# Altium project CurrentSensor_PCB.PrjPcb
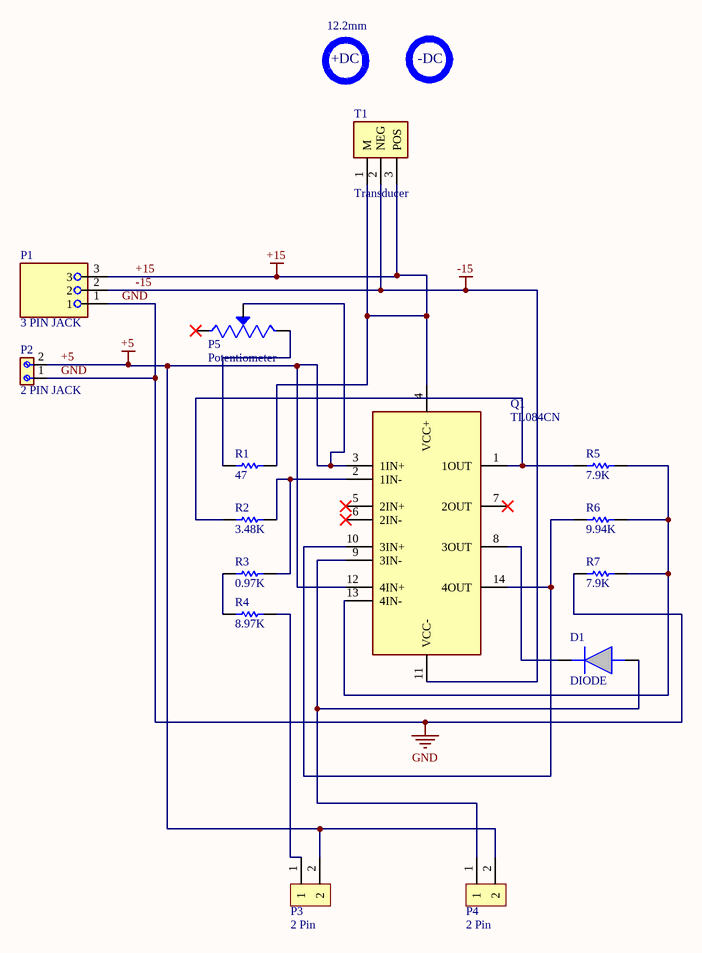
[diagram p0: Sheet1.SchDoc]
3 sheets, 123 parts. Net scope: global (net labels, ports and power ports of the same name join across sheets).
Board files: PCB1.PcbDoc, PCB2.PcbDoc, PCB3.PcbDoc
Sheets:
  Sheet1.SchDoc
  Sheet2.SchDoc
  Sheet3.SchDoc

## Sheet Sheet1.SchDoc
size A4; SheetNumber: 1; SheetTotal: 1

### Parts
D1  DIODE  [Diode]
P1  3 PIN JACK  [3 PIN JACK]
P2  2 PIN JACK  [2 PIN JACK]
P3  2 Pin  [2 PIN]
P4  2 Pin  [2 PIN]
P5  Potentiometer  [Potentiometer]
Q1  TL084CN  [TL084CN]
R1  47  [47]
R2  3.48K  [3.48K]
R3  0.97K  [0.97K]
R4  8.97K  [8.97K]
R5  7.9K  [7.90K]
R6  9.94K  [9.94K]
R7  7.9K  [7.90K]
T1  Transducer  [Transducer]

### Nets
+5: P2.2 P3.2 P4.2 P5.2(WIPER) Q1.3(1IN+) Q1.12(4IN+)
+15: P1.3 Q1.4(VCC+) R1.2 T1.1(M) T1.3(POS)
-15: P1.2 Q1.11(VCC-) T1.2(NEG)
GND: P1.1 P2.1 R7.1
NetD1_1: D1.1(K) Q1.8(3OUT)
NetD1_2: D1.2(A) P4.1 Q1.9(3IN-)
NetP3_1: P3.1 R4.2
NetP5_3: P5.3(CW) R1.1
NetQ1_1: Q1.1(1OUT) R2.1 R5.1
NetQ1_2: Q1.2(1IN-) R2.2 R3.2
NetQ1_10: Q1.10(3IN+) Q1.14(4OUT) R6.1
NetQ1_13: Q1.13(4IN-) R5.2 R6.2 R7.2
NetR3_1: R3.1 R4.1

Not connected (* = marked no-connect by the designer): P5 1(CCW)*; Q1 5(2IN+)* 6(2IN-)* 7(2OUT)*

### Notes on the sheet
- 12.2mm
- +DC
- -DC

### Library data of the parts
D1 = DIODE: 1N4007S
P3 P4 = 2 Pin: 22272021
R1 = 47: MFR-25FRF52-47R
R2 = 3.48K: MFR-25FBF52-3K48
R3 = 0.97K: MFR-25FRF52-976R
R4 = 8.97K: MFR-25FBF52-8K87
R5 R7 = 7.9K: MFR-25FBF52-7K87
R6 = 9.94K: MFR-25FTE52-9K76
T1 = Transducer: LA55-P

## Sheet Sheet2.SchDoc
size A2; SheetNumber: 2; SheetTotal: 2
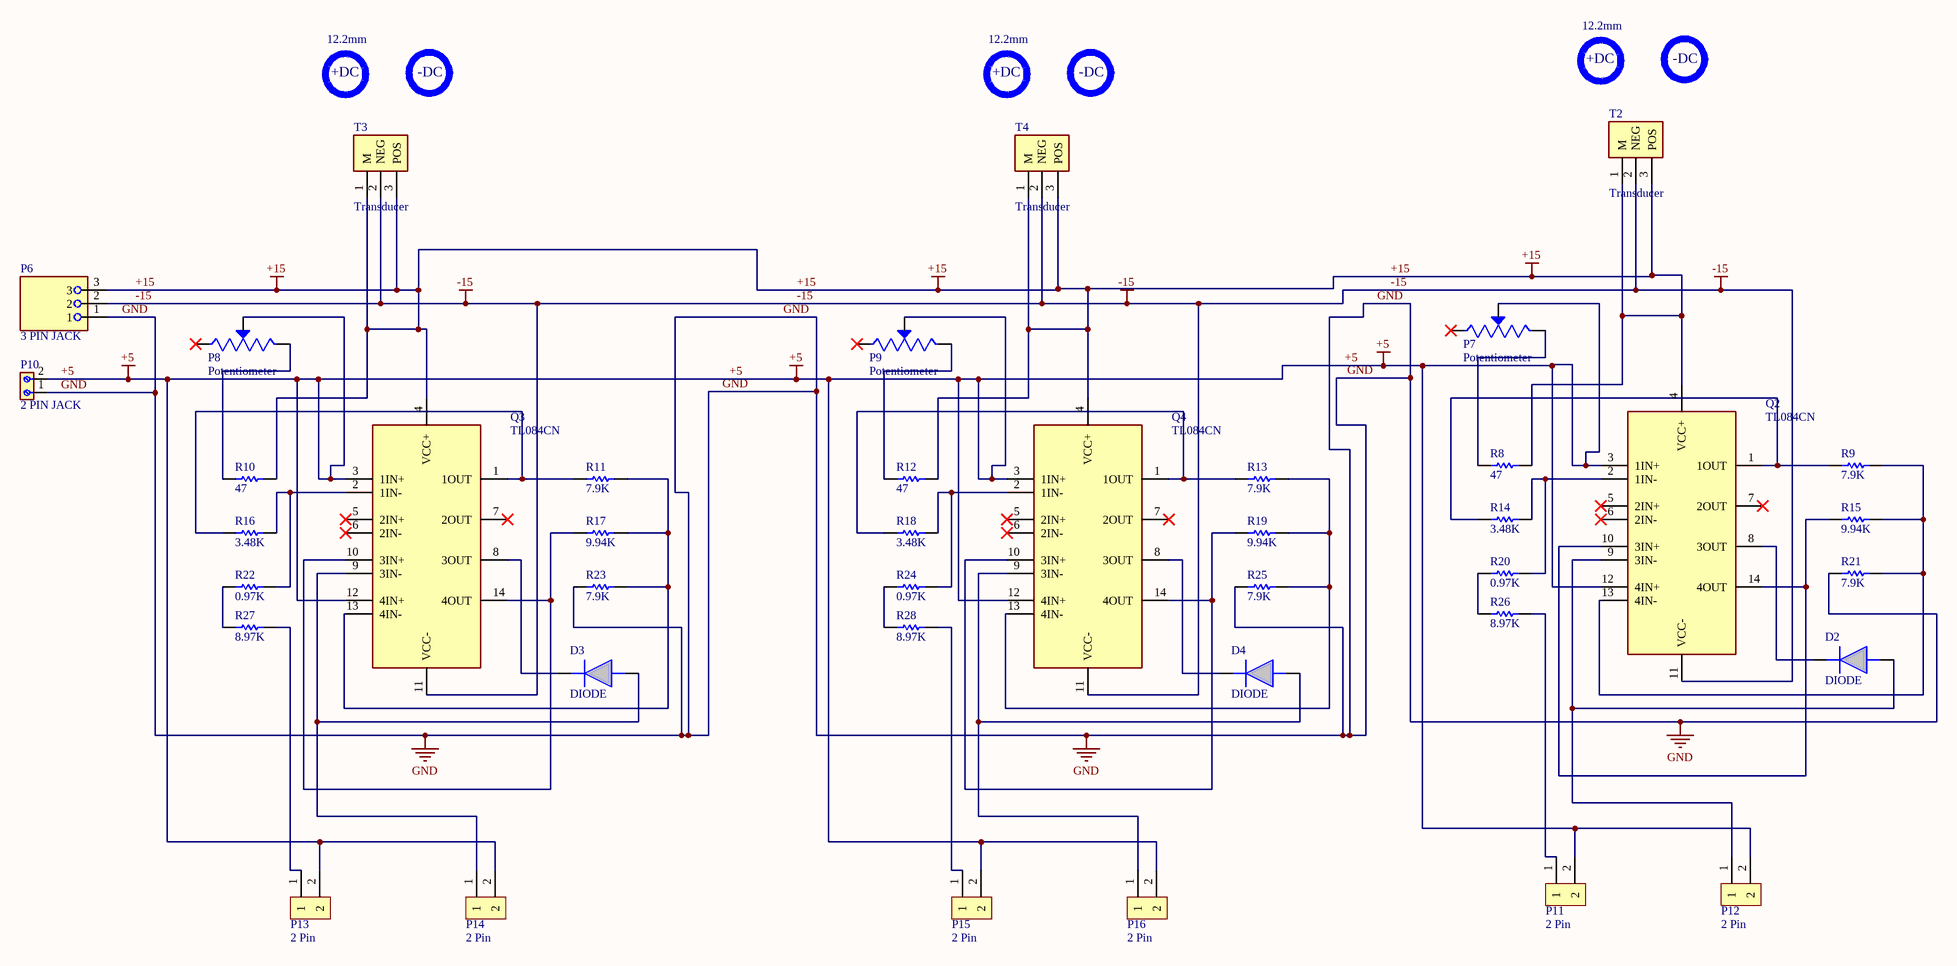
[diagram p1: Sheet2.SchDoc]

### Parts
D2  DIODE  [Diode]
D3  DIODE  [Diode]
D4  DIODE  [Diode]
P6  3 PIN JACK  [3 PIN JACK]
P7  Potentiometer  [Potentiometer]
P8  Potentiometer  [Potentiometer]
P9  Potentiometer  [Potentiometer]
P10  2 PIN JACK  [2 PIN JACK]
P11  2 Pin  [2 PIN]
P12  2 Pin  [2 PIN]
P13  2 Pin  [2 PIN]
P14  2 Pin  [2 PIN]
P15  2 Pin  [2 PIN]
P16  2 Pin  [2 PIN]
Q2  TL084CN  [TL084CN]
Q3  TL084CN  [TL084CN]
Q4  TL084CN  [TL084CN]
R8  47  [47]
R9  7.9K  [7.90K]
R10  47  [47]
R11  7.9K  [7.90K]
R12  47  [47]
R13  7.9K  [7.90K]
R14  3.48K  [3.48K]
R15  9.94K  [9.94K]
R16  3.48K  [3.48K]
R17  9.94K  [9.94K]
R18  3.48K  [3.48K]
R19  9.94K  [9.94K]
R20  0.97K  [0.97K]
R21  7.9K  [7.90K]
R22  0.97K  [0.97K]
R23  7.9K  [7.90K]
R24  0.97K  [0.97K]
R25  7.9K  [7.90K]
R26  8.97K  [8.97K]
R27  8.97K  [8.97K]
R28  8.97K  [8.97K]
T2  Transducer  [Transducer]
T3  Transducer  [Transducer]
T4  Transducer  [Transducer]

### Nets
+5: P7.2(WIPER) P8.2(WIPER) P9.2(WIPER) P10.2 P11.2 P12.2 P13.2 P14.2 P15.2 P16.2 Q2.3(1IN+) Q2.12(4IN+) Q3.3(1IN+) Q3.12(4IN+) Q4.3(1IN+) Q4.12(4IN+)
+15: P6.3 Q2.4(VCC+) Q3.4(VCC+) Q4.4(VCC+) R8.2 R10.2 R12.2 T2.1(M) T2.3(POS) T3.1(M) T3.3(POS) T4.1(M) T4.3(POS)
-15: P6.2 Q2.11(VCC-) Q3.11(VCC-) Q4.11(VCC-) T2.2(NEG) T3.2(NEG) T4.2(NEG)
GND: P6.1 P10.1 R21.1 R23.1 R25.1
NetD2_1: D2.1(K) Q2.8(3OUT)
NetD2_2: D2.2(A) P12.1 Q2.9(3IN-)
NetD3_1: D3.1(K) Q3.8(3OUT)
NetD3_2: D3.2(A) P14.1 Q3.9(3IN-)
NetD4_1: D4.1(K) Q4.8(3OUT)
NetD4_2: D4.2(A) P16.1 Q4.9(3IN-)
NetP7_3: P7.3(CW) R8.1
NetP8_3: P8.3(CW) R10.1
NetP9_3: P9.3(CW) R12.1
NetP11_1: P11.1 R26.2
NetP13_1: P13.1 R27.2
NetP15_1: P15.1 R28.2
NetQ2_1: Q2.1(1OUT) R9.1 R14.1
NetQ2_2: Q2.2(1IN-) R14.2 R20.2
NetQ2_10: Q2.10(3IN+) Q2.14(4OUT) R15.1
NetQ2_13: Q2.13(4IN-) R9.2 R15.2 R21.2
NetQ3_1: Q3.1(1OUT) R11.1 R16.1
NetQ3_2: Q3.2(1IN-) R16.2 R22.2
NetQ3_10: Q3.10(3IN+) Q3.14(4OUT) R17.1
NetQ3_13: Q3.13(4IN-) R11.2 R17.2 R23.2
NetQ4_1: Q4.1(1OUT) R13.1 R18.1
NetQ4_2: Q4.2(1IN-) R18.2 R24.2
NetQ4_10: Q4.10(3IN+) Q4.14(4OUT) R19.1
NetQ4_13: Q4.13(4IN-) R13.2 R19.2 R25.2
NetR20_1: R20.1 R26.1
NetR22_1: R22.1 R27.1
NetR24_1: R24.1 R28.1

Not connected (* = marked no-connect by the designer): P7 1(CCW)*; P8 1(CCW)*; P9 1(CCW)*; Q2 5(2IN+)* 6(2IN-)* 7(2OUT)*; Q3 5(2IN+)* 6(2IN-)* 7(2OUT)*; Q4 5(2IN+)* 6(2IN-)* 7(2OUT)*

### Notes on the sheet
- 12.2mm
- +DC
- -DC

### Library data of the parts
D2-D4 = DIODE: 1N4007S
P11-P16 = 2 Pin: 22272021
R8 R10 R12 = 47: MFR-25FRF52-47R
R9 R11 R13 R21 R23 R25 = 7.9K: MFR-25FBF52-7K87
R14 R16 R18 = 3.48K: MFR-25FBF52-3K48
R15 R17 R19 = 9.94K: MFR-25FTE52-9K76
R20 R22 R24 = 0.97K: MFR-25FRF52-976R
R26-R28 = 8.97K: MFR-25FBF52-8K87
T2-T4 = Transducer: LA55-P

## Sheet Sheet3.SchDoc
size A1; SheetNumber: 3; SheetTotal: 3
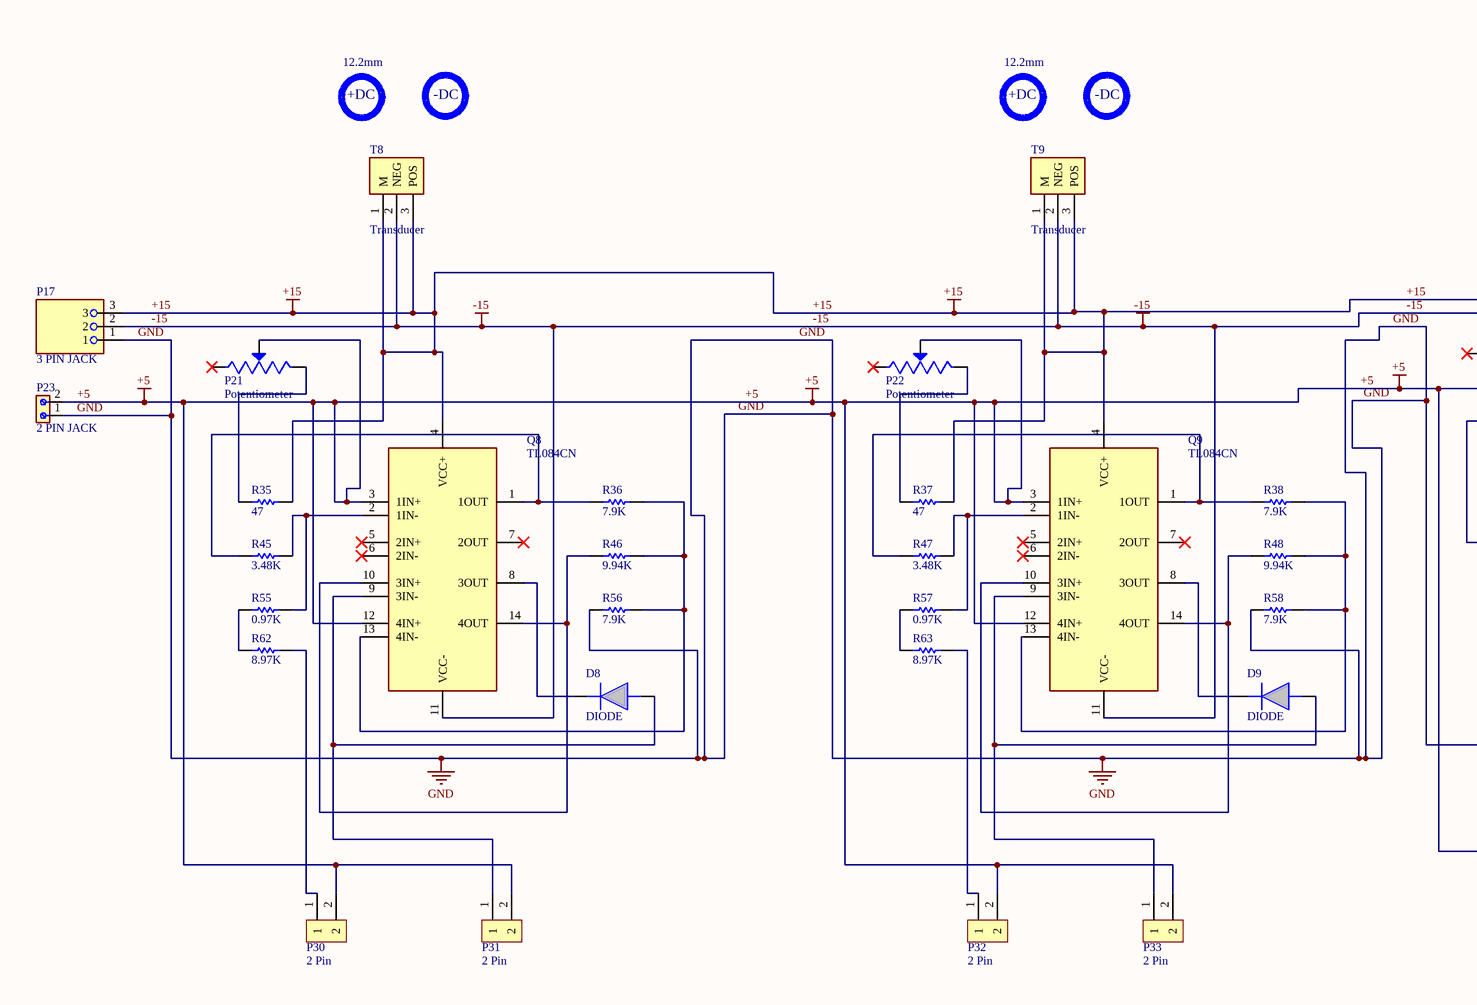
[diagram p2: Sheet3.SchDoc, left]
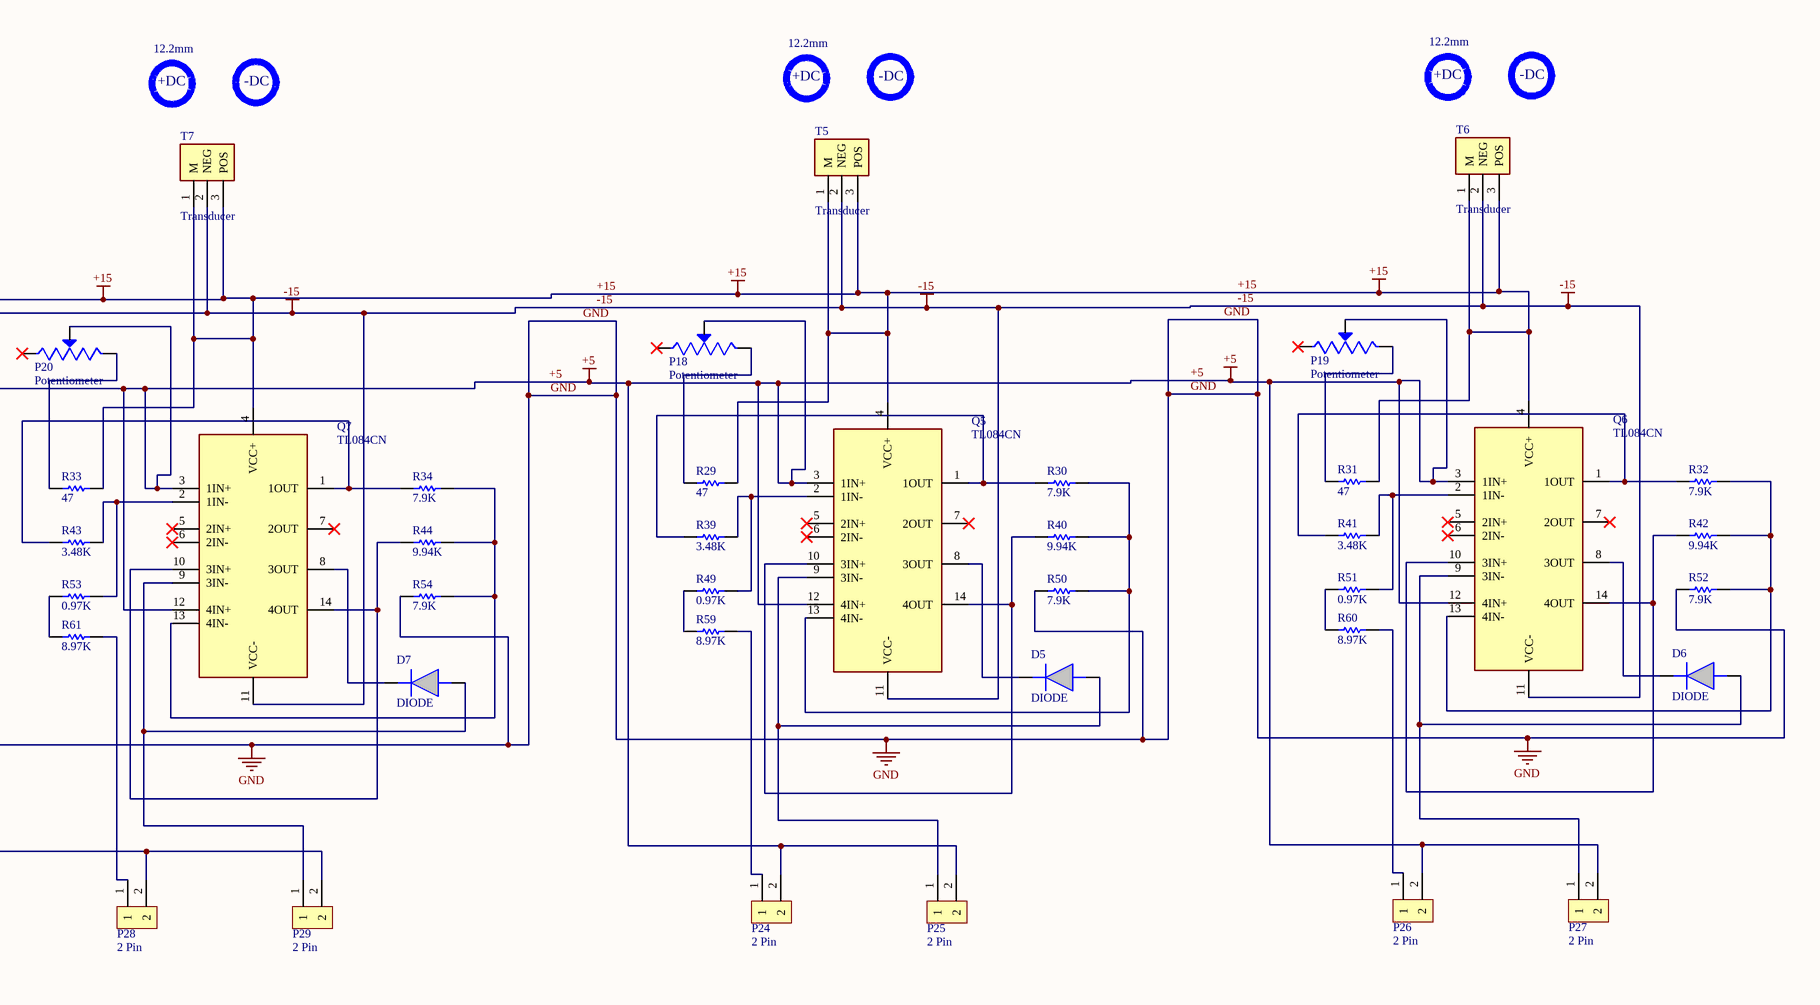
[diagram p3: Sheet3.SchDoc, right]

### Parts
D5  DIODE  [Diode]
D6  DIODE  [Diode]
D7  DIODE  [Diode]
D8  DIODE  [Diode]
D9  DIODE  [Diode]
P17  3 PIN JACK  [3 PIN JACK]
P18  Potentiometer  [Potentiometer]
P19  Potentiometer  [Potentiometer]
P20  Potentiometer  [Potentiometer]
P21  Potentiometer  [Potentiometer]
P22  Potentiometer  [Potentiometer]
P23  2 PIN JACK  [2 PIN JACK]
P24  2 Pin  [2 PIN]
P25  2 Pin  [2 PIN]
P26  2 Pin  [2 PIN]
P27  2 Pin  [2 PIN]
P28  2 Pin  [2 PIN]
P29  2 Pin  [2 PIN]
P30  2 Pin  [2 PIN]
P31  2 Pin  [2 PIN]
P32  2 Pin  [2 PIN]
P33  2 Pin  [2 PIN]
Q5  TL084CN  [TL084CN]
Q6  TL084CN  [TL084CN]
Q7  TL084CN  [TL084CN]
Q8  TL084CN  [TL084CN]
Q9  TL084CN  [TL084CN]
R29  47  [47]
R30  7.9K  [7.90K]
R31  47  [47]
R32  7.9K  [7.90K]
R33  47  [47]
R34  7.9K  [7.90K]
R35  47  [47]
R36  7.9K  [7.90K]
R37  47  [47]
R38  7.9K  [7.90K]
R39  3.48K  [3.48K]
R40  9.94K  [9.94K]
R41  3.48K  [3.48K]
R42  9.94K  [9.94K]
R43  3.48K  [3.48K]
R44  9.94K  [9.94K]
R45  3.48K  [3.48K]
R46  9.94K  [9.94K]
R47  3.48K  [3.48K]
R48  9.94K  [9.94K]
R49  0.97K  [0.97K]
R50  7.9K  [7.90K]
R51  0.97K  [0.97K]
R52  7.9K  [7.90K]
R53  0.97K  [0.97K]
R54  7.9K  [7.90K]
R55  0.97K  [0.97K]
R56  7.9K  [7.90K]
R57  0.97K  [0.97K]
R58  7.9K  [7.90K]
R59  8.97K  [8.97K]
R60  8.97K  [8.97K]
R61  8.97K  [8.97K]
R62  8.97K  [8.97K]
R63  8.97K  [8.97K]
T5  Transducer  [Transducer]
T6  Transducer  [Transducer]
T7  Transducer  [Transducer]
T8  Transducer  [Transducer]
T9  Transducer  [Transducer]

### Nets
+5: P18.2(WIPER) P19.2(WIPER) P20.2(WIPER) P21.2(WIPER) P22.2(WIPER) P23.2 P24.2 P25.2 P26.2 P27.2 P28.2 P29.2 P30.2 P31.2 P32.2 P33.2 Q5.3(1IN+) Q5.12(4IN+) Q6.3(1IN+) Q6.12(4IN+) Q7.3(1IN+) Q7.12(4IN+) Q8.3(1IN+) Q8.12(4IN+) Q9.3(1IN+) Q9.12(4IN+)
+15: P17.3 Q5.4(VCC+) Q6.4(VCC+) Q7.4(VCC+) Q8.4(VCC+) Q9.4(VCC+) R29.2 R31.2 R33.2 R35.2 R37.2 T5.1(M) T5.3(POS) T6.1(M) T6.3(POS) T7.1(M) T7.3(POS) T8.1(M) T8.3(POS) T9.1(M) T9.3(POS)
-15: P17.2 Q5.11(VCC-) Q6.11(VCC-) Q7.11(VCC-) Q8.11(VCC-) Q9.11(VCC-) T5.2(NEG) T6.2(NEG) T7.2(NEG) T8.2(NEG) T9.2(NEG)
GND: P17.1 P23.1 R50.1 R52.1 R54.1 R56.1 R58.1
NetD5_1: D5.1(K) Q5.8(3OUT)
NetD5_2: D5.2(A) P25.1 Q5.9(3IN-)
NetD6_1: D6.1(K) Q6.8(3OUT)
NetD6_2: D6.2(A) P27.1 Q6.9(3IN-)
NetD7_1: D7.1(K) Q7.8(3OUT)
NetD7_2: D7.2(A) P29.1 Q7.9(3IN-)
NetD8_1: D8.1(K) Q8.8(3OUT)
NetD8_2: D8.2(A) P31.1 Q8.9(3IN-)
NetD9_1: D9.1(K) Q9.8(3OUT)
NetD9_2: D9.2(A) P33.1 Q9.9(3IN-)
NetP18_3: P18.3(CW) R29.1
NetP19_3: P19.3(CW) R31.1
NetP20_3: P20.3(CW) R33.1
NetP21_3: P21.3(CW) R35.1
NetP22_3: P22.3(CW) R37.1
NetP24_1: P24.1 R59.2
NetP26_1: P26.1 R60.2
NetP28_1: P28.1 R61.2
NetP30_1: P30.1 R62.2
NetP32_1: P32.1 R63.2
NetQ5_1: Q5.1(1OUT) R30.1 R39.1
NetQ5_2: Q5.2(1IN-) R39.2 R49.2
NetQ5_10: Q5.10(3IN+) Q5.14(4OUT) R40.1
NetQ5_13: Q5.13(4IN-) R30.2 R40.2 R50.2
NetQ6_1: Q6.1(1OUT) R32.1 R41.1
NetQ6_2: Q6.2(1IN-) R41.2 R51.2
NetQ6_10: Q6.10(3IN+) Q6.14(4OUT) R42.1
NetQ6_13: Q6.13(4IN-) R32.2 R42.2 R52.2
NetQ7_1: Q7.1(1OUT) R34.1 R43.1
NetQ7_2: Q7.2(1IN-) R43.2 R53.2
NetQ7_10: Q7.10(3IN+) Q7.14(4OUT) R44.1
NetQ7_13: Q7.13(4IN-) R34.2 R44.2 R54.2
NetQ8_1: Q8.1(1OUT) R36.1 R45.1
NetQ8_2: Q8.2(1IN-) R45.2 R55.2
NetQ8_10: Q8.10(3IN+) Q8.14(4OUT) R46.1
NetQ8_13: Q8.13(4IN-) R36.2 R46.2 R56.2
NetQ9_1: Q9.1(1OUT) R38.1 R47.1
NetQ9_2: Q9.2(1IN-) R47.2 R57.2
NetQ9_10: Q9.10(3IN+) Q9.14(4OUT) R48.1
NetQ9_13: Q9.13(4IN-) R38.2 R48.2 R58.2
NetR49_1: R49.1 R59.1
NetR51_1: R51.1 R60.1
NetR53_1: R53.1 R61.1
NetR55_1: R55.1 R62.1
NetR57_1: R57.1 R63.1

Not connected (* = marked no-connect by the designer): P18 1(CCW)*; P19 1(CCW)*; P20 1(CCW)*; P21 1(CCW)*; P22 1(CCW)*; Q5 5(2IN+)* 6(2IN-)* 7(2OUT)*; Q6 5(2IN+)* 6(2IN-)* 7(2OUT)*; Q7 5(2IN+)* 6(2IN-)* 7(2OUT)*; Q8 5(2IN+)* 6(2IN-)* 7(2OUT)*; Q9 5(2IN+)* 6(2IN-)* 7(2OUT)*

### Notes on the sheet
- 12.2mm
- +DC
- -DC

### Library data of the parts
D5-D9 = DIODE: 1N4007S
P24-P33 = 2 Pin: 22272021
R29 R31 R33 R35 R37 = 47: MFR-25FRF52-47R
R30 R32 R34 R36 R38 R50 R52 R54 R56 R58 = 7.9K: MFR-25FBF52-7K87
R39 R41 R43 R45 R47 = 3.48K: MFR-25FBF52-3K48
R40 R42 R44 R46 R48 = 9.94K: MFR-25FTE52-9K76
R49 R51 R53 R55 R57 = 0.97K: MFR-25FRF52-976R
R59-R63 = 8.97K: MFR-25FBF52-8K87
T5-T9 = Transducer: LA55-P

## Nets that join several sheets
+5: Sheet1 (6 pins), Sheet2 (16 pins), Sheet3 (26 pins)
+15: Sheet1 (5 pins), Sheet2 (13 pins), Sheet3 (21 pins)
-15: Sheet1 (P1.2 Q1.11 T1.2), Sheet2 (7 pins), Sheet3 (11 pins)
GND: Sheet1 (P1.1 P2.1 R7.1), Sheet2 (5 pins), Sheet3 (7 pins)